# EAGLE schematic 68030-RAM-IDE-V02 (EAGLE 6.6.0)

## Sheet 1 of 3
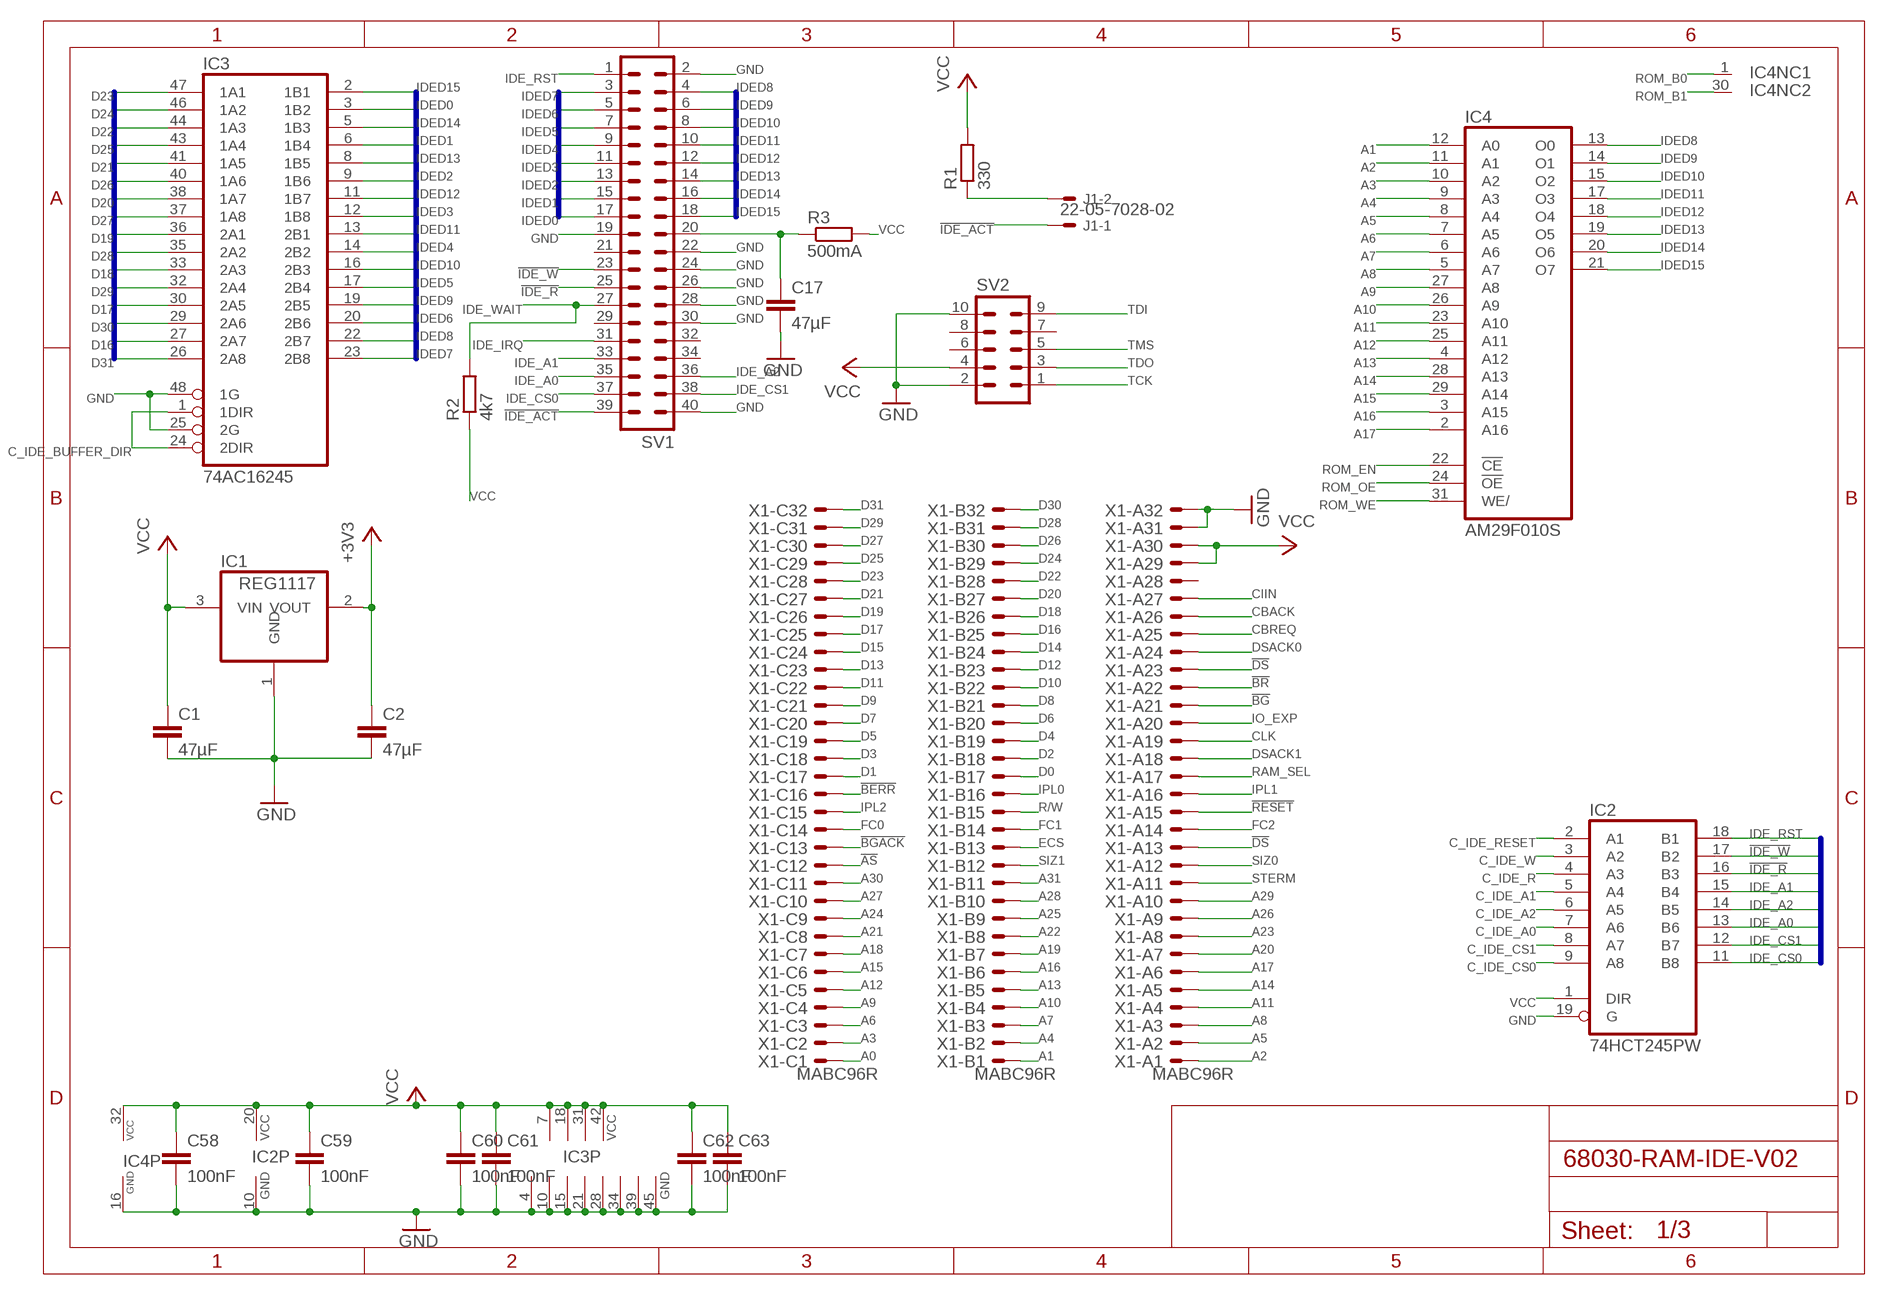
[diagram p0: schematic, sheet 1]

### Parts
C1  47µF  C-EUC0805K  [C0805K]
C2  47µF  C-EUC0805K  [C0805K]
C17  47µF  C-EUC0805K  [C0805K]
C58  100nF  C-EUC0603K  [C0603K]
C59  100nF  C-EUC0603K  [C0603K]
C60  100nF  C-EUC0603K  [C0603K]
C61  100nF  C-EUC0603K  [C0603K]
C62  100nF  C-EUC0603K  [C0603K]
C63  100nF  C-EUC0603K  [C0603K]
IC1  REG1117  [SOT223]
IC2  74HCT245PW  [TSSOP20]
IC3  74AC16245  [SSOP48DL]
IC4  AM29F010S  [PLCC-SR32]
J1  22-05-7028-02  [7395-02]
R1  330  R-EU_R0603  [R0603]
R2  4k7  R-EU_R0603  [R0603]
R3  500mA  R-EU_R2512  [R2512]
SV1  ML40  [ML40]
SV2  ML10  [ML10]
X1  MABC96R  [MABC96R]

### Nets
!AS: X1.C12 ; also sheet 3
!BERR: X1.C16
!BG: X1.A21
!BGACK: X1.C13
!BR: X1.A22
!DS: X1.A13 X1.A23 ; also sheet 3
!IDE_ACT: J1.1 SV1.39
!IDE_R: IC2.16(B3) SV1.25
!IDE_W: IC2.17(B2) SV1.23
!RESET: X1.A15 ; also sheet 3
+3V3: C2.1 IC1.2(VOUT) ; also sheet 2,3
A0: X1.C1 ; also sheet 3
A1: IC4.12(A0) X1.B1 ; also sheet 3
A2: IC4.11(A1) X1.A1 ; also sheet 3
A3: IC4.10(A2) X1.C2 ; also sheet 3
A4: IC4.9(A3) X1.B2 ; also sheet 3
A5: IC4.8(A4) X1.A2 ; also sheet 3
A6: IC4.7(A5) X1.C3 ; also sheet 3
A7: IC4.6(A6) X1.B3 ; also sheet 3
A8: IC4.5(A7) X1.A3 ; also sheet 3
A9: IC4.27(A8) X1.C4 ; also sheet 3
A10: IC4.26(A9) X1.B4 ; also sheet 3
A11: IC4.23(A10) X1.A4 ; also sheet 3
A12: IC4.25(A11) X1.C5 ; also sheet 3
A13: IC4.4(A12) X1.B5 ; also sheet 3
A14: IC4.28(A13) X1.A5 ; also sheet 3
A15: IC4.29(A14) X1.C6 ; also sheet 3
A16: IC4.3(A15) X1.B6 ; also sheet 3
A17: IC4.2(A16) X1.A6 ; also sheet 3
A18: X1.C7 ; also sheet 3
A19: X1.B7 ; also sheet 3
A20: X1.A7 ; also sheet 3
A21: X1.C8 ; also sheet 3
A22: X1.B8 ; also sheet 3
A23: X1.A8 ; also sheet 3
A24: X1.C9 ; also sheet 3
A25: X1.B9 ; also sheet 3
A26: X1.A9 ; also sheet 3
A27: X1.C10 ; also sheet 3
A28: X1.B10 ; also sheet 3
A29: X1.A10 ; also sheet 3
A30: X1.C11 ; also sheet 3
A31: X1.B11 ; also sheet 3
C_IDE_A0: IC2.7(A6) ; also sheet 3
C_IDE_A1: IC2.5(A4) ; also sheet 3
C_IDE_A2: IC2.6(A5) ; also sheet 3
C_IDE_BUFFER_DIR: IC3.1(1DIR) IC3.24(2DIR) ; also sheet 3
C_IDE_CS0: IC2.9(A8) ; also sheet 3
C_IDE_CS1: IC2.8(A7) ; also sheet 3
C_IDE_R: IC2.4(A3) ; also sheet 3
C_IDE_RESET: IC2.2(A1) ; also sheet 3
C_IDE_W: IC2.3(A2) ; also sheet 3
CBACK: X1.A26 ; also sheet 3
CBREQ: X1.A25 ; also sheet 3
CIIN: X1.A27 ; also sheet 3
CLK: X1.A19 ; also sheet 3
D0: X1.B17 ; also sheet 2
D1: X1.C17 ; also sheet 2
D2: X1.B18 ; also sheet 2
D3: X1.C18 ; also sheet 2
D4: X1.B19 ; also sheet 2
D5: X1.C19 ; also sheet 2
D6: X1.B20 ; also sheet 2
D7: X1.C20 ; also sheet 2
D8: X1.B21 ; also sheet 2
D9: X1.C21 ; also sheet 2
D10: X1.B22 ; also sheet 2
D11: X1.C22 ; also sheet 2
D12: X1.B23 ; also sheet 2
D13: X1.C23 ; also sheet 2
D14: X1.B24 ; also sheet 2
D15: X1.C24 ; also sheet 2
D16: IC3.27(2A7) X1.B25 ; also sheet 2
D17: IC3.30(2A5) X1.C25 ; also sheet 2
D18: IC3.33(2A3) X1.B26 ; also sheet 2
D19: IC3.36(2A1) X1.C26 ; also sheet 2
D20: IC3.38(1A7) X1.B27 ; also sheet 2
D21: IC3.41(1A5) X1.C27 ; also sheet 2
D22: IC3.44(1A3) X1.B28 ; also sheet 2
D23: IC3.47(1A1) X1.C28 ; also sheet 2
D24: IC3.46(1A2) X1.B29 ; also sheet 2
D25: IC3.43(1A4) X1.C29 ; also sheet 2
D26: IC3.40(1A6) X1.B30 ; also sheet 2
D27: IC3.37(1A8) X1.C30 ; also sheet 2
D28: IC3.35(2A2) X1.B31 ; also sheet 2,3
D29: IC3.32(2A4) X1.C31 ; also sheet 2,3
D30: IC3.29(2A6) X1.B32 ; also sheet 2,3
D31: IC3.26(2A8) X1.C32 ; also sheet 2,3
DSACK0: X1.A24 ; also sheet 3
DSACK1: X1.A18 ; also sheet 3
ECS: X1.B13 ; also sheet 3
FC0: X1.C14
FC1: X1.B14
FC2: X1.A14
GND: C1.2 C2.2 C17.2 C58.2 C59.2 C60.2 C61.2 C62.2 C63.2 IC1.1(GND) IC2.10(GND) IC2.19(G) IC3.4(GND) IC3.10(GND) IC3.15(GND) IC3.21(GND) IC3.25(2G) IC3.28(GND) IC3.34(GND) IC3.39(GND) IC3.45(GND) IC3.48(1G) IC4.16(GND) SV1.2 SV1.19 SV1.22 SV1.24 SV1.26 SV1.28 SV1.30 SV1.40 SV2.2 SV2.10 X1.A31 X1.A32 ; also sheet 2,3
IDE_A0: IC2.13(B6) SV1.35
IDE_A1: IC2.15(B4) SV1.33
IDE_A2: IC2.14(B5) SV1.36
IDE_CS0: IC2.11(B8) SV1.37
IDE_CS1: IC2.12(B7) SV1.38
IDE_IRQ: SV1.31
IDE_RST: IC2.18(B1) SV1.1
IDE_WAIT: R2.2 SV1.27 ; also sheet 3
IDED0: IC3.3(1B2) SV1.17
IDED1: IC3.6(1B4) SV1.15
IDED2: IC3.9(1B6) SV1.13
IDED3: IC3.12(1B8) SV1.11
IDED4: IC3.14(2B2) SV1.9
IDED5: IC3.17(2B4) SV1.7
IDED6: IC3.20(2B6) SV1.5
IDED7: IC3.23(2B8) SV1.3
IDED8: IC3.22(2B7) IC4.13(O0) SV1.4
IDED9: IC3.19(2B5) IC4.14(O1) SV1.6
IDED10: IC3.16(2B3) IC4.15(O2) SV1.8
IDED11: IC3.13(2B1) IC4.17(O3) SV1.10
IDED12: IC3.11(1B7) IC4.18(O4) SV1.12
IDED13: IC3.8(1B5) IC4.19(O5) SV1.14
IDED14: IC3.5(1B3) IC4.20(O6) SV1.16
IDED15: IC3.2(1B1) IC4.21(O7) SV1.18
IO_EXP: X1.A20 ; also sheet 3
IPL0: X1.B16
IPL1: X1.A16
IPL2: X1.C15
KEY_PIN_POWER: C17.1 R3.1 SV1.20
N$25: J1.2 R1.1
R/W: X1.B15 ; also sheet 3
RAM_SEL: X1.A17 ; also sheet 3
ROM_B0: IC4.1(NC) ; also sheet 3
ROM_B1: IC4.30(NC) ; also sheet 3
ROM_EN: IC4.22(!CE) ; also sheet 3
ROM_OE: IC4.24(!OE) ; also sheet 3
ROM_WE: IC4.31(WE/) ; also sheet 3
SIZ0: X1.A12 ; also sheet 3
SIZ1: X1.B12 ; also sheet 3
STERM: X1.A11 ; also sheet 3
TCK: SV2.1 ; also sheet 3
TDI: SV2.9 ; also sheet 3
TDO: SV2.3 ; also sheet 3
TMS: SV2.5 ; also sheet 3
VCC: C1.1 C58.1 C59.1 C60.1 C61.1 C62.1 C63.1 IC1.3(VIN) IC2.1(DIR) IC2.20(VCC) IC3.7(VCC) IC3.18(VCC) IC3.31(VCC) IC3.42(VCC) IC4.32(VCC) R1.2 R2.1 R3.2 SV2.4 X1.A29 X1.A30 ; also sheet 3
Unconnected: SV1.21 SV1.29 SV1.32 SV1.34 SV2.6 SV2.7 SV2.8 X1.A28

### Buses
IDED[0..15]
D[0..31]
IDE_RST,IDE_A[0..2],IDE_CS[0..1],!IDE_R,!IDE_W

## Sheet 2 of 3
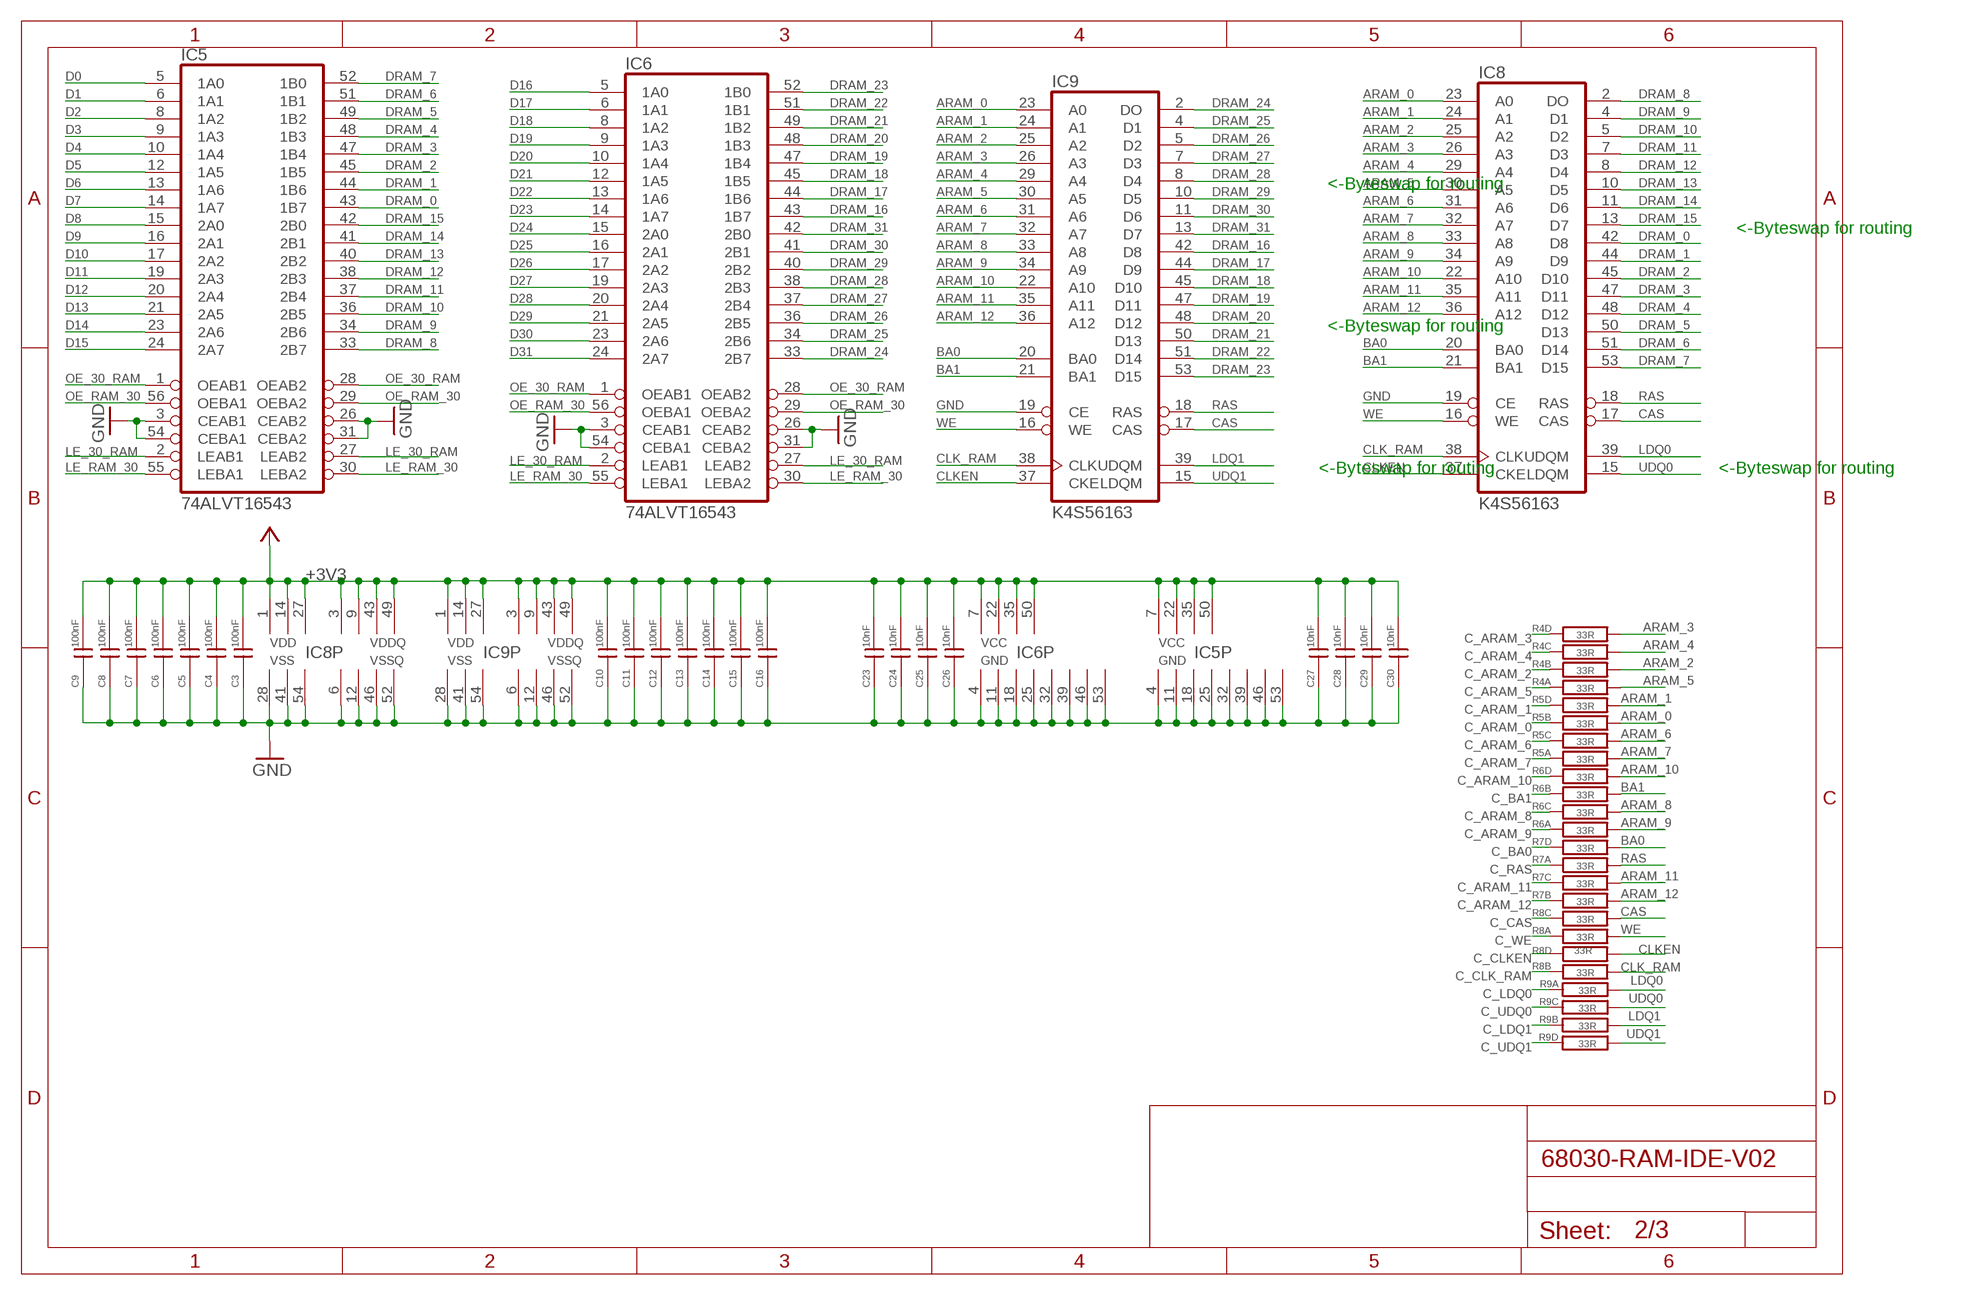
[diagram p1: schematic, sheet 2]

### Parts
C3  100nF  C-0805-K  [0805]
C4  100nF  C-0805-K  [0805]
C5  100nF  C-0805-K  [0805]
C6  100nF  C-0805-K  [0805]
C7  100nF  C-0805-K  [0805]
C8  100nF  C-0805-K  [0805]
C9  100nF  C-0805-K  [0805]
C10  100nF  C-0805-K  [0805]
C11  100nF  C-0805-K  [0805]
C12  100nF  C-0805-K  [0805]
C13  100nF  C-0805-K  [0805]
C14  100nF  C-0805-K  [0805]
C15  100nF  C-0805-K  [0805]
C16  100nF  C-0805-K  [0805]
C23  10nF  C-0603-K@3  [0603@3]
C24  10nF  C-0603-K@3  [0603@3]
C25  10nF  C-0603-K@3  [0603@3]
C26  10nF  C-0603-K@3  [0603@3]
C27  10nF  C-0603-K@3  [0603@3]
C28  10nF  C-0603-K@3  [0603@3]
C29  10nF  C-0603-K@3  [0603@3]
C30  10nF  C-0603-K@3  [0603@3]
IC5  74ALVT16543  ABT16543@2  [TSSOP56@2]
IC6  74ALVT16543  ABT16543@2  [TSSOP56@2]
IC8  K4S56163  K4S56163@2  [TSOP2-54@2]
IC9  K4S56163  K4S56163@2  [TSOP2-54@2]
R4  33R  R-NETZ@3  [R-NETZ@2]
R5  33R  R-NETZ@3  [R-NETZ@2]
R6  33R  R-NETZ@3  [R-NETZ@2]
R7  33R  R-NETZ@3  [R-NETZ@2]
R8  33R  R-NETZ@3  [R-NETZ@2]
R9  33R  R-NETZ@3  [R-NETZ@2]

### Nets
+3V3: C3.1 C4.1 C5.1 C6.1 C7.1 C8.1 C9.1 C10.1 C11.1 C12.1 C13.1 C14.1 C15.1 C16.1 C23.1 C24.1 C25.1 C26.1 C27.1 C28.1 C29.1 C30.1 IC5.7(VCC) IC5.22(VCC) IC5.35(VCC) IC5.50(VCC) IC6.7(VCC) IC6.22(VCC) IC6.35(VCC) IC6.50(VCC) IC8.1(VCC) IC8.3(VCC) IC8.9(VCC) IC8.14(VCC) IC8.27(VCC) IC8.43(VCC) IC8.49(VCC) IC9.1(VCC) IC9.3(VCC) IC9.9(VCC) IC9.14(VCC) IC9.27(VCC) IC9.43(VCC) IC9.49(VCC) ; supply symbol labelled 3,3V ; also sheet 1,3
ARAM_0: IC8.23(A0) IC9.23(A0) R5.P$2
ARAM_1: IC8.24(A1) IC9.24(A1) R5.P$4
ARAM_2: IC8.25(A2) IC9.25(A2) R4.P$2
ARAM_3: IC8.26(A3) IC9.26(A3) R4.P$4
ARAM_4: IC8.29(A4) IC9.29(A4) R4.P$3
ARAM_5: IC8.30(A5) IC9.30(A5) R4.P$1
ARAM_6: IC8.31(A6) IC9.31(A6) R5.P$3
ARAM_7: IC8.32(A7) IC9.32(A7) R5.P$1
ARAM_8: IC8.33(A8) IC9.33(A8) R6.P$3
ARAM_9: IC8.34(A9) IC9.34(A9) R6.P$1
ARAM_10: IC8.22(A10) IC9.22(A10) R6.P$4
ARAM_11: IC8.35(A11) IC9.35(A11) R7.P$3
ARAM_12: IC8.36(A12) IC9.36(A12) R7.P$2
BA0: IC8.20(BA0) IC9.20(BA0) R7.P$4
BA1: IC8.21(BA1) IC9.21(BA1) R6.P$2
C_ARAM_0: R5.P$7 ; also sheet 3
C_ARAM_1: R5.P$5 ; also sheet 3
C_ARAM_2: R4.P$7 ; also sheet 3
C_ARAM_3: R4.P$5 ; also sheet 3
C_ARAM_4: R4.P$6 ; also sheet 3
C_ARAM_5: R4.P$8 ; also sheet 3
C_ARAM_6: R5.P$6 ; also sheet 3
C_ARAM_7: R5.P$8 ; also sheet 3
C_ARAM_8: R6.P$6 ; also sheet 3
C_ARAM_9: R6.P$8 ; also sheet 3
C_ARAM_10: R6.P$5 ; also sheet 3
C_ARAM_11: R7.P$6 ; also sheet 3
C_ARAM_12: R7.P$7 ; also sheet 3
C_BA0: R7.P$5 ; also sheet 3
C_BA1: R6.P$7 ; also sheet 3
C_CAS: R8.P$6 ; also sheet 3
C_CLK_RAM: R8.P$7 ; also sheet 3
C_CLKEN: R8.P$5 ; also sheet 3
C_LDQ0: R9.P$1 ; also sheet 3
C_LDQ1: R9.P$2 ; also sheet 3
C_RAS: R7.P$8 ; also sheet 3
C_UDQ0: R9.P$3 ; also sheet 3
C_UDQ1: R9.P$4 ; also sheet 3
C_WE: R8.P$8 ; also sheet 3
CAS: IC8.17(CAS) IC9.17(CAS) R8.P$3
CLK_RAM: IC8.38(CLK) IC9.38(CLK) R8.P$2
CLKEN: IC8.37(CKE) IC9.37(CKE) R8.P$4
D0: IC5.5(1A0) ; also sheet 1
D1: IC5.6(1A1) ; also sheet 1
D2: IC5.8(1A2) ; also sheet 1
D3: IC5.9(1A3) ; also sheet 1
D4: IC5.10(1A4) ; also sheet 1
D5: IC5.12(1A5) ; also sheet 1
D6: IC5.13(1A6) ; also sheet 1
D7: IC5.14(1A7) ; also sheet 1
D8: IC5.15(2A0) ; also sheet 1
D9: IC5.16(2A1) ; also sheet 1
D10: IC5.17(2A2) ; also sheet 1
D11: IC5.19(2A3) ; also sheet 1
D12: IC5.20(2A4) ; also sheet 1
D13: IC5.21(2A5) ; also sheet 1
D14: IC5.23(2A6) ; also sheet 1
D15: IC5.24(2A7) ; also sheet 1
D16: IC6.5(1A0) ; also sheet 1
D17: IC6.6(1A1) ; also sheet 1
D18: IC6.8(1A2) ; also sheet 1
D19: IC6.9(1A3) ; also sheet 1
D20: IC6.10(1A4) ; also sheet 1
D21: IC6.12(1A5) ; also sheet 1
D22: IC6.13(1A6) ; also sheet 1
D23: IC6.14(1A7) ; also sheet 1
D24: IC6.15(2A0) ; also sheet 1
D25: IC6.16(2A1) ; also sheet 1
D26: IC6.17(2A2) ; also sheet 1
D27: IC6.19(2A3) ; also sheet 1
D28: IC6.20(2A4) ; also sheet 1,3
D29: IC6.21(2A5) ; also sheet 1,3
D30: IC6.23(2A6) ; also sheet 1,3
D31: IC6.24(2A7) ; also sheet 1,3
DRAM_0: IC5.43(1B7) IC8.42(D8)
DRAM_1: IC5.44(1B6) IC8.44(D9)
DRAM_2: IC5.45(1B5) IC8.45(D10)
DRAM_3: IC5.47(1B4) IC8.47(D11)
DRAM_4: IC5.48(1B3) IC8.48(D12)
DRAM_5: IC5.49(1B2) IC8.50(D13)
DRAM_6: IC5.51(1B1) IC8.51(D14)
DRAM_7: IC5.52(1B0) IC8.53(D15)
DRAM_8: IC5.33(2B7) IC8.2(DO)
DRAM_9: IC5.34(2B6) IC8.4(D1)
DRAM_10: IC5.36(2B5) IC8.5(D2)
DRAM_11: IC5.37(2B4) IC8.7(D3)
DRAM_12: IC5.38(2B3) IC8.8(D4)
DRAM_13: IC5.40(2B2) IC8.10(D5)
DRAM_14: IC5.41(2B1) IC8.11(D6)
DRAM_15: IC5.42(2B0) IC8.13(D7)
DRAM_16: IC6.43(1B7) IC9.42(D8)
DRAM_17: IC6.44(1B6) IC9.44(D9)
DRAM_18: IC6.45(1B5) IC9.45(D10)
DRAM_19: IC6.47(1B4) IC9.47(D11)
DRAM_20: IC6.48(1B3) IC9.48(D12)
DRAM_21: IC6.49(1B2) IC9.50(D13)
DRAM_22: IC6.51(1B1) IC9.51(D14)
DRAM_23: IC6.52(1B0) IC9.53(D15)
DRAM_24: IC6.33(2B7) IC9.2(DO)
DRAM_25: IC6.34(2B6) IC9.4(D1)
DRAM_26: IC6.36(2B5) IC9.5(D2)
DRAM_27: IC6.37(2B4) IC9.7(D3)
DRAM_28: IC6.38(2B3) IC9.8(D4)
DRAM_29: IC6.40(2B2) IC9.10(D5)
DRAM_30: IC6.41(2B1) IC9.11(D6)
DRAM_31: IC6.42(2B0) IC9.13(D7)
GND: C3.2 C4.2 C5.2 C6.2 C7.2 C8.2 C9.2 C10.2 C11.2 C12.2 C13.2 C14.2 C15.2 C16.2 C23.2 C24.2 C25.2 C26.2 C27.2 C28.2 C29.2 C30.2 IC5.3(CEAB1) IC5.4(GND) IC5.11(GND) IC5.18(GND) IC5.25(GND) IC5.26(CEAB2) IC5.31(CEBA2) IC5.32(GND) IC5.39(GND) IC5.46(GND) IC5.53(GND) IC5.54(CEBA1) IC6.3(CEAB1) IC6.4(GND) IC6.11(GND) IC6.18(GND) IC6.25(GND) IC6.26(CEAB2) IC6.31(CEBA2) IC6.32(GND) IC6.39(GND) IC6.46(GND) IC6.53(GND) IC6.54(CEBA1) IC8.6(GND) IC8.12(GND) IC8.19(CE) IC8.28(GND) IC8.41(GND) IC8.46(GND) IC8.52(GND) IC8.54(GND) IC9.6(GND) IC9.12(GND) IC9.19(CE) IC9.28(GND) IC9.41(GND) IC9.46(GND) IC9.52(GND) IC9.54(GND) ; also sheet 1,3
LDQ0: IC8.39(UDQM) R9.P$8
LDQ1: IC9.39(UDQM) R9.P$7
LE_30_RAM: IC5.2(LEAB1) IC5.27(LEAB2) IC6.2(LEAB1) IC6.27(LEAB2) ; also sheet 3
LE_RAM_30: IC5.30(LEBA2) IC5.55(LEBA1) IC6.30(LEBA2) IC6.55(LEBA1) ; also sheet 3
OE_30_RAM: IC5.1(OEAB1) IC5.28(OEAB2) IC6.1(OEAB1) IC6.28(OEAB2) ; also sheet 3
OE_RAM_30: IC5.29(OEBA2) IC5.56(OEBA1) IC6.29(OEBA2) IC6.56(OEBA1) ; also sheet 3
RAS: IC8.18(RAS) IC9.18(RAS) R7.P$1
UDQ0: IC8.15(LDQM) R9.P$6
UDQ1: IC9.15(LDQM) R9.P$5
WE: IC8.16(WE) IC9.16(WE) R8.P$1

### Notes on the sheet
- <-Byteswap for routing
- <-Byteswap for routing
- <-Byteswap for routing
- <-Byteswap for routing | <-Byteswap for routing

## Sheet 3 of 3
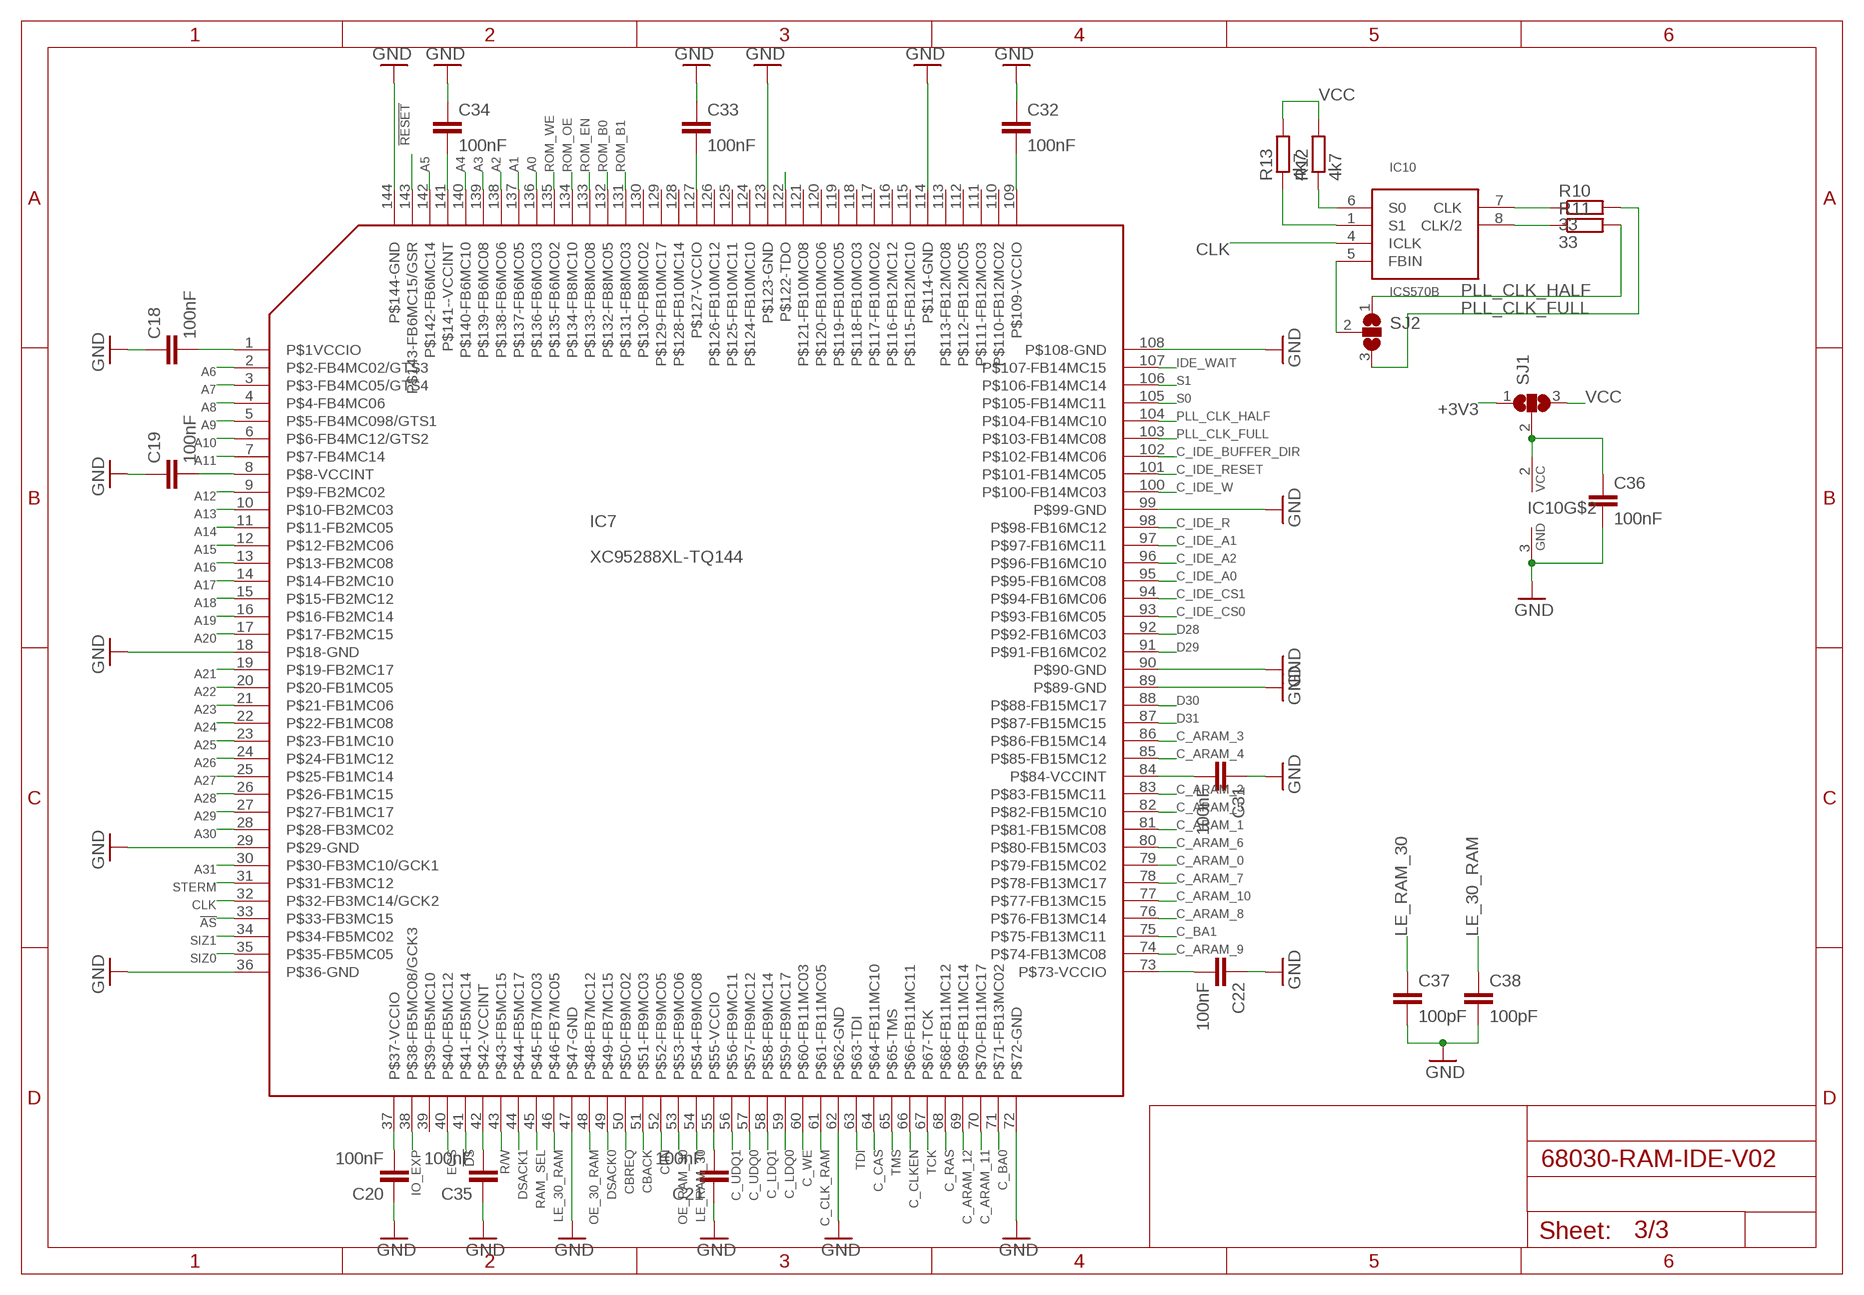
[diagram p2: schematic, sheet 3]

### Parts
C18  100nF  C-EUC0603K  [C0603K]
C19  100nF  C-EUC0603K  [C0603K]
C20  100nF  C-EUC0603K  [C0603K]
C21  100nF  C-EUC0603K  [C0603K]
C22  100nF  C-EUC0603K  [C0603K]
C31  100nF  C-EUC0603K  [C0603K]
C32  100nF  C-EUC0603K  [C0603K]
C33  100nF  C-EUC0603K  [C0603K]
C34  100nF  C-EUC0603K  [C0603K]
C35  100nF  C-EUC0603K  [C0603K]
C36  100nF  C-EUC0603K  [C0603K]
C37  100pF  C-EUC0603K  [C0603K]
C38  100pF  C-EUC0603K  [C0603K]
IC7  XC95288XL-TQ144  [TQFP144]
IC10  ICS570B  [SO-8]
R10  33  R-EU_R0603  [R0603]
R11  33  R-EU_R0603  [R0603]
R12  4k7  R-EU_R0603  [R0603]
R13  4k7  R-EU_R0603  [R0603]
SJ1  SJ2W  [SJ_2]
SJ2  SJ2W  [SJ_2]

### Nets
!AS: IC7.33(P$33-FB3MC15) ; also sheet 1
!DS: IC7.41(P$41-FB5MC14) ; also sheet 1
!RESET: IC7.143(P$143-FB6MC15/GSR) ; also sheet 1
+3V3: C18.2 C19.2 C20.2 C21.2 C22.2 C31.2 C32.2 C33.2 C34.2 C35.2 IC7.1(P$1VCCIO) IC7.8(P$8-VCCINT) IC7.37(P$37-VCCIO) IC7.42(P$42-VCCINT) IC7.55(P$55-VCCIO) IC7.73(P$73-VCCIO) IC7.84(P$84-VCCINT) IC7.109(P$109-VCCIO) IC7.127(P$127-VCCIO) IC7.141(P$141--VCCINT) SJ1.1 ; also sheet 1,2
A0: IC7.136(P$136-FB6MC03) ; also sheet 1
A1: IC7.137(P$137-FB6MC05) ; also sheet 1
A2: IC7.138(P$138-FB6MC06) ; also sheet 1
A3: IC7.139(P$139-FB6MC08) ; also sheet 1
A4: IC7.140(P$140-FB6MC10) ; also sheet 1
A5: IC7.142(P$142-FB6MC14) ; also sheet 1
A6: IC7.2(P$2-FB4MC02/GTS3) ; also sheet 1
A7: IC7.3(P$3-FB4MC05/GTS4) ; also sheet 1
A8: IC7.4(P$4-FB4MC06) ; also sheet 1
A9: IC7.5(P$5-FB4MC098/GTS1) ; also sheet 1
A10: IC7.6(P$6-FB4MC12/GTS2) ; also sheet 1
A11: IC7.7(P$7-FB4MC14) ; also sheet 1
A12: IC7.9(P$9-FB2MC02) ; also sheet 1
A13: IC7.10(P$10-FB2MC03) ; also sheet 1
A14: IC7.11(P$11-FB2MC05) ; also sheet 1
A15: IC7.12(P$12-FB2MC06) ; also sheet 1
A16: IC7.13(P$13-FB2MC08) ; also sheet 1
A17: IC7.14(P$14-FB2MC10) ; also sheet 1
A18: IC7.15(P$15-FB2MC12) ; also sheet 1
A19: IC7.16(P$16-FB2MC14) ; also sheet 1
A20: IC7.17(P$17-FB2MC15) ; also sheet 1
A21: IC7.19(P$19-FB2MC17) ; also sheet 1
A22: IC7.20(P$20-FB1MC05) ; also sheet 1
A23: IC7.21(P$21-FB1MC06) ; also sheet 1
A24: IC7.22(P$22-FB1MC08) ; also sheet 1
A25: IC7.23(P$23-FB1MC10) ; also sheet 1
A26: IC7.24(P$24-FB1MC12) ; also sheet 1
A27: IC7.25(P$25-FB1MC14) ; also sheet 1
A28: IC7.26(P$26-FB1MC15) ; also sheet 1
A29: IC7.27(P$27-FB1MC17) ; also sheet 1
A30: IC7.28(P$28-FB3MC02) ; also sheet 1
A31: IC7.30(P$30-FB3MC10/GCK1) ; also sheet 1
C_ARAM_0: IC7.79(P$79-FB15MC02) ; also sheet 2
C_ARAM_1: IC7.81(P$81-FB15MC08) ; also sheet 2
C_ARAM_2: IC7.83(P$83-FB15MC11) ; also sheet 2
C_ARAM_3: IC7.86(P$86-FB15MC14) ; also sheet 2
C_ARAM_4: IC7.85(P$85-FB15MC12) ; also sheet 2
C_ARAM_5: IC7.82(P$82-FB15MC10) ; also sheet 2
C_ARAM_6: IC7.80(P$80-FB15MC03) ; also sheet 2
C_ARAM_7: IC7.78(P$78-FB13MC17) ; also sheet 2
C_ARAM_8: IC7.76(P$76-FB13MC14) ; also sheet 2
C_ARAM_9: IC7.74(P$74-FB13MC08) ; also sheet 2
C_ARAM_10: IC7.77(P$77-FB13MC15) ; also sheet 2
C_ARAM_11: IC7.70(P$70-FB11MC17) ; also sheet 2
C_ARAM_12: IC7.69(P$69-FB11MC14) ; also sheet 2
C_BA0: IC7.71(P$71-FB13MC02) ; also sheet 2
C_BA1: IC7.75(P$75-FB13MC11) ; also sheet 2
C_CAS: IC7.64(P$64-FB11MC10) ; also sheet 2
C_CLK_RAM: IC7.61(P$61-FB11MC05) ; also sheet 2
C_CLKEN: IC7.66(P$66-FB11MC11) ; also sheet 2
C_IDE_A0: IC7.95(P$95-FB16MC08) ; also sheet 1
C_IDE_A1: IC7.97(P$97-FB16MC11) ; also sheet 1
C_IDE_A2: IC7.96(P$96-FB16MC10) ; also sheet 1
C_IDE_BUFFER_DIR: IC7.102(P$102-FB14MC06) ; also sheet 1
C_IDE_CS0: IC7.93(P$93-FB16MC05) ; also sheet 1
C_IDE_CS1: IC7.94(P$94-FB16MC06) ; also sheet 1
C_IDE_R: IC7.98(P$98-FB16MC12) ; also sheet 1
C_IDE_RESET: IC7.101(P$101-FB14MC05) ; also sheet 1
C_IDE_W: IC7.100(P$100-FB14MC03) ; also sheet 1
C_LDQ0: IC7.59(P$59-FB9MC17) ; also sheet 2
C_LDQ1: IC7.58(P$58-FB9MC14) ; also sheet 2
C_RAS: IC7.68(P$68-FB11MC12) ; also sheet 2
C_UDQ0: IC7.57(P$57-FB9MC12) ; also sheet 2
C_UDQ1: IC7.56(P$56-FB9MC11) ; also sheet 2
C_WE: IC7.60(P$60-FB11MC03) ; also sheet 2
CBACK: IC7.51(P$51-FB9MC03) ; also sheet 1
CBREQ: IC7.50(P$50-FB9MC02) ; also sheet 1
CIIN: IC7.52(P$52-FB9MC05) ; also sheet 1
CLK: IC7.32(P$32-FB3MC14/GCK2) IC10.4(ICLK) ; also sheet 1
D28: IC7.92(P$92-FB16MC03) ; also sheet 1,2
D29: IC7.91(P$91-FB16MC02) ; also sheet 1,2
D30: IC7.88(P$88-FB15MC17) ; also sheet 1,2
D31: IC7.87(P$87-FB15MC15) ; also sheet 1,2
DSACK0: IC7.49(P$49-FB7MC15) ; also sheet 1
DSACK1: IC7.44(P$44-FB5MC17) ; also sheet 1
ECS: IC7.40(P$40-FB5MC12) ; also sheet 1
GND: C18.1 C19.1 C20.1 C21.1 C22.1 C31.1 C32.1 C33.1 C34.1 C35.1 C36.2 C37.2 C38.2 IC7.18(P$18-GND) IC7.29(P$29-GND) IC7.36(P$36-GND) IC7.47(P$47-GND) IC7.62(P$62-GND) IC7.72(P$72-GND) IC7.89(P$89-GND) IC7.90(P$90-GND) IC7.99(P$99-GND) IC7.108(P$108-GND) IC7.114(P$114-GND) IC7.123(P$123-GND) IC7.144(P$144-GND) IC10.3(GND) ; also sheet 1,2
IDE_WAIT: IC7.107(P$107-FB14MC15) ; also sheet 1
IO_EXP: IC7.38(P$38-FB5MC08/GCK3) ; also sheet 1
LE_30_RAM: C38.1 IC7.46(P$46-FB7MC05) ; also sheet 2
LE_RAM_30: C37.1 IC7.54(P$54-FB9MC08) ; also sheet 2
N$1: C36.1 IC10.2(VCC) SJ1.2
N$4: IC10.7(CLK) R10.1
N$5: IC10.8(CLK/2) R11.1
N$8: IC10.5(FBIN) SJ2.2
OE_30_RAM: IC7.48(P$48-FB7MC12) ; also sheet 2
OE_RAM_30: IC7.53(P$53-FB9MC06) ; also sheet 2
PLL_CLK_FULL: IC7.103(P$103-FB14MC08) R10.2 SJ2.3
PLL_CLK_HALF: IC7.104(P$104-FB14MC10) R11.2 SJ2.1
R/W: IC7.43(P$43-FB5MC15) ; also sheet 1
RAM_SEL: IC7.45(P$45-FB7MC03) ; also sheet 1
ROM_B0: IC7.132(P$132-FB8MC05) ; also sheet 1
ROM_B1: IC7.131(P$131-FB8MC03) ; also sheet 1
ROM_EN: IC7.133(P$133-FB8MC08) ; also sheet 1
ROM_OE: IC7.134(P$134-FB8MC10) ; also sheet 1
ROM_WE: IC7.135(P$135-FB6MC02) ; also sheet 1
S0: IC7.105(P$105-FB14MC11) IC10.6(S0) R12.1
S1: IC7.106(P$106-FB14MC14) IC10.1(S1) R13.1
SIZ0: IC7.35(P$35-FB5MC05) ; also sheet 1
SIZ1: IC7.34(P$34-FB5MC02) ; also sheet 1
STERM: IC7.31(P$31-FB3MC12) ; also sheet 1
TCK: IC7.67(P$67-TCK) ; also sheet 1
TDI: IC7.63(P$63-TDI) ; also sheet 1
TDO: IC7.122(P$122-TDO) ; also sheet 1
TMS: IC7.65(P$65-TMS) ; also sheet 1
VCC: R12.2 R13.2 SJ1.3 ; also sheet 1
Unconnected: IC7.39(P$39-FB5MC10) IC7.110(P$110-FB12MC02) IC7.111(P$111-FB12MC03) IC7.112(P$112-FB12MC05) IC7.113(P$113-FB12MC08) IC7.115(P$115-FB12MC10) IC7.116(P$116-FB12MC12) IC7.117(P$117-FB10MC02) IC7.118(P$118-FB10MC03) IC7.119(P$119-FB10MC05) IC7.120(P$120-FB10MC06) IC7.121(P$121-FB10MC08) IC7.124(P$124-FB10MC10) IC7.125(P$125-FB10MC11) IC7.126(P$126-FB10MC12) IC7.128(P$128-FB10MC14) IC7.129(P$129-FB10MC17) IC7.130(P$130-FB8MC02)

## Library data of the parts
C1 C2 C17-C22 C31-C38 C58-C63 = rcl:C-EU: CAPACITOR, European symbol
C3-C16 = SMD:C-0805-K
C23-C30 = SMD:C-0603-K@3
IC1 = burr-brown:REG1117: 800mA and 1A Low Dropout (LDO) Positive Regulator 1.8V, 2.5V, 2.85V, 3.3V, 5V, and Adj; MPN: REG1117; OC_FARNELL: 1097566; OC_NEWARK: 14P6981
IC2 = 74xx-eu:74*245: Octal BUS TRANSCEIVER, 3-state
IC3 = 74ac-logic:74AC16245: 16-bit BUS TRANSCEIVER, 3-state
IC4 = am29-memory:AM29F010S: 1-Megabit FLASH MEMORY (128 K x 8 bit) 5 V-only
IC5 IC6 = SMD-IC:ABT16543@2
IC7 = xilinx_xc9572xl-tq100:XC95288XL-TQ144
IC8 IC9 = SMD-IC:K4S56163@2
IC10 = IDT:ICS570: Multiplier with FBIN=CLK/2: S1 S0 CLK 0 0 Tristate 0 nc x6 0 1 x8 nc 0 x16 nc nc x12 nc 1 x20 1 0 x2 1 nc x32 1 1 x4; SUPPLY: 3.3V
J1 = con-molex:22-?-02: CONNECTOR wire to board 2.54 mm (.1 inch) pitch header; OC_FARNELL: 9731601; OC_NEWARK: unknown
R1-R3 R10-R13 = rcl:R-EU_: RESISTOR, European symbol
R4-R9 = SMD:R-NETZ@3
SJ1 SJ2 = jumper:SJ2W: SMD solder JUMPER
SV1 = con-harting-ml:ML40: HARTING; OC_FARNELL: unknown; OC_NEWARK: unknown
SV2 = con-harting-ml:ML10: HARTING; OC_FARNELL: unknown; OC_NEWARK: unknown
X1 = con-vg:MABC96R: CONNECTOR male, 96 pins, type R, rows ABC, grid 2.54 mm